# Altium project DC-DC_Converter.PrjPcb
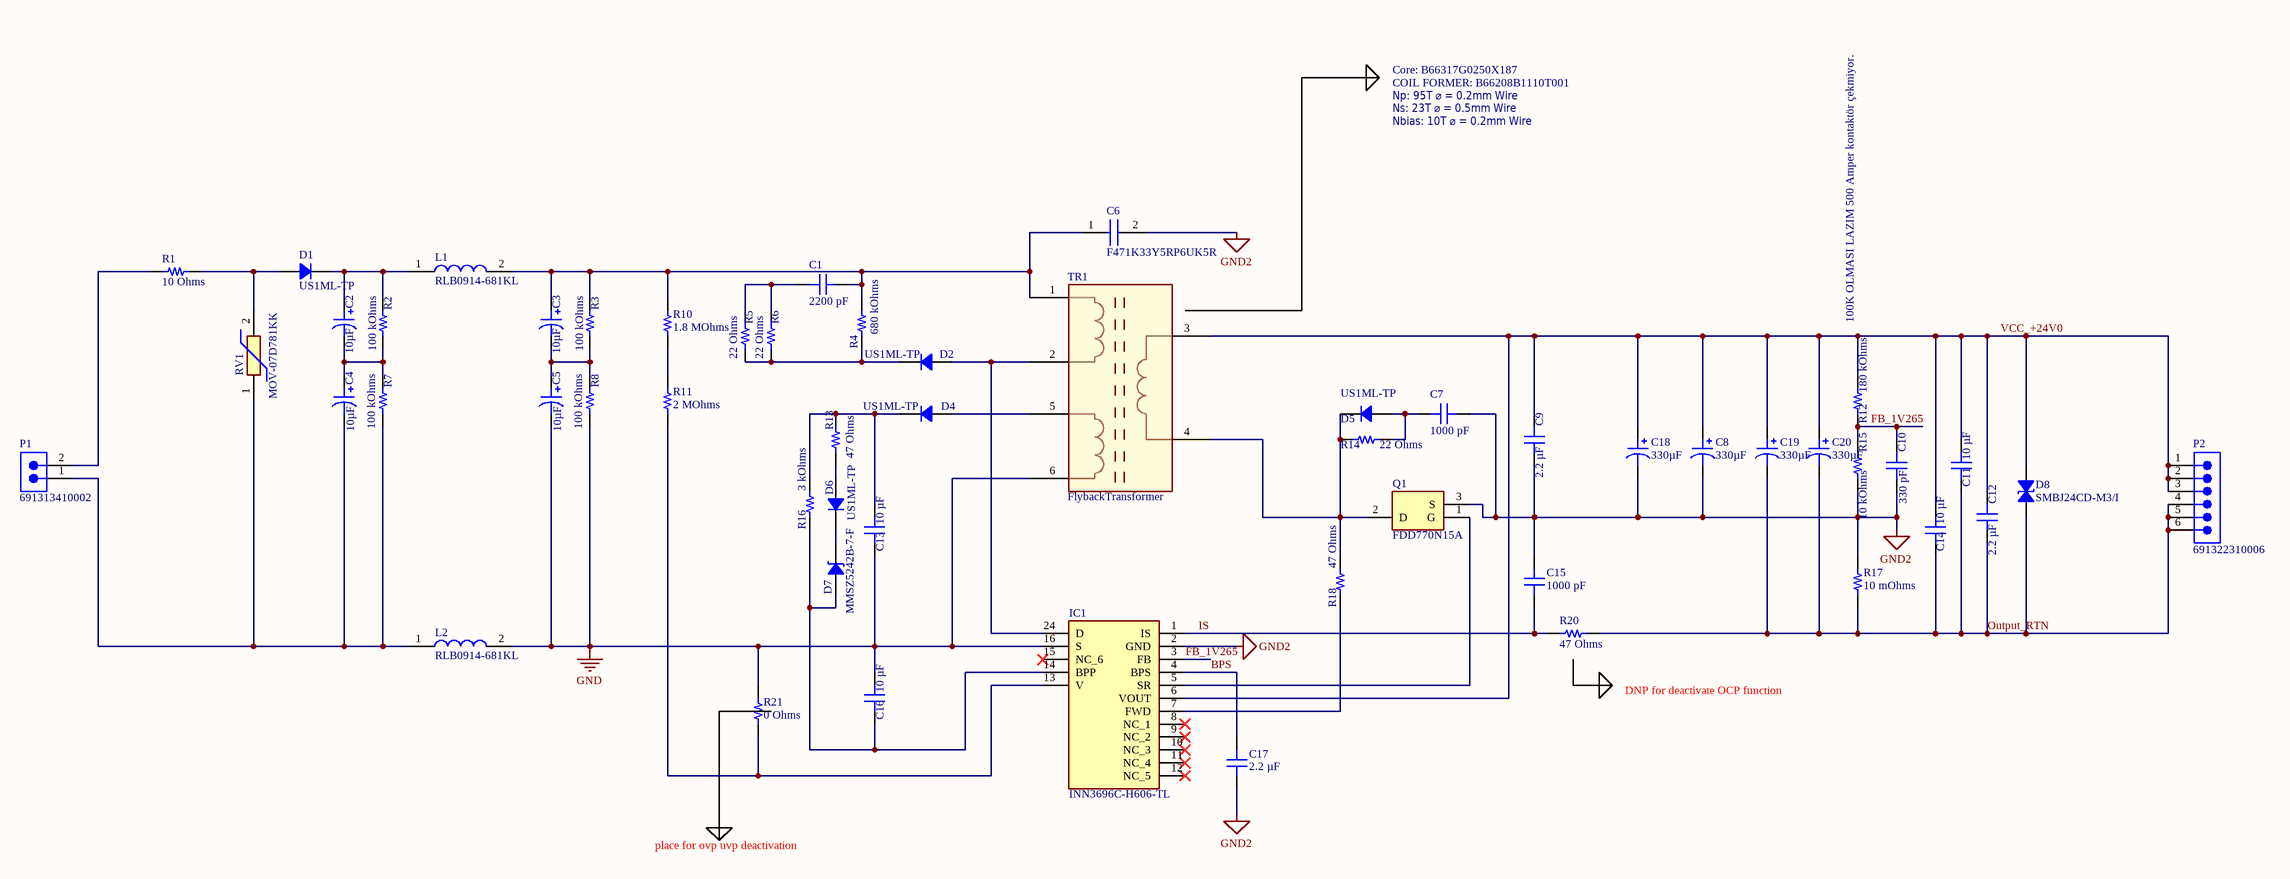
[diagram p0: Main.SchDoc]
CAGE_CODE: ?????; CONTRACT_NUMBER: <CONTRACT NO>; DOC_NO_ASSY_DWG: <ASSY DWG NO>; DOC_NO_BOM: <BOM DOC NO>; DOC_NO_FAB_DWG: <FAB DWG NO>; DOC_NO_SCH_DWG: <SCH DWG NO>; PCB_2_DEC_TOL: +/-.01; PCB_3_DEC_TOL: +/-.010; PCB_ANG_TOL: +/-1/2; PCB_ASSEMBLY_NO: <PCB ASSY NO>; PCB_CHECKER: - -----; PCB_CHECKER_APP_DATE: --/--/----; PCB_DESIGNER: - -----; PCB_DESIGNER_APP_DATE: --/--/----; PCB_DWG_NO: <PCB DWG NO>; PCB_ENGINEER: - -----; PCB_ENGINEER_APP_DATE: --/--/----; PCB_PART_NUMBER: <PCB PN>; PCB_REV: A; SCH_REV: A
1 sheet, 54 parts. Net scope: global (net labels, ports and power ports of the same name join across sheets).
Board file: PCB1.PcbDoc

## Sheet Main.SchDoc
size C; SheetNumber: 1; SheetTotal: 1

### Parts
C1  value 2200 pF  [CAP 1206_3216 - 0.8MM]  (hidden comment: C1206X222KGRAC7800)
C2  value 10µF  [CAP TH ALUM ELEC D10.00mm S5.00mm H17.00mm]  (hidden comment: ESK106M400AH2EA)
C3  value 10µF  [CAP TH ALUM ELEC D10.00mm S5.00mm H17.00mm]  (hidden comment: ESK106M400AH2EA)
C4  value 10µF  [CAP TH ALUM ELEC D10.00mm S5.00mm H17.00mm]  (hidden comment: ESK106M400AH2EA)
C5  value 10µF  [CAP TH ALUM ELEC D10.00mm S5.00mm H17.00mm]  (hidden comment: ESK106M400AH2EA)
C6  F471K33Y5RP6UK5R  [F471K33Y5RP6UK5R]
C7  value 1000 pF  [CAP 0603_1608]  (hidden comment: CL10B102KB8NNNC)
C8  value 330µF  [CAP TH ALUM ELEC D10.00mm S5.00mm H14.00mm]  (hidden comment: UVY1V331MPD1TD)
C9  value 2.2 µF  [CAP 1206_3216 - 0.8MM]  (hidden comment: CL31B225KBHNNNE)
C10  value 330 pF  [CAP 1206_3216 - 0.8MM]  (hidden comment: 885012208072)
C11  value 10 µF  [CAP 1206_3216 - 0.8MM]  (hidden comment: CL31A106MBHNNNE)
C12  value 2.2 µF  [CAP 1206_3216 - 0.8MM]  (hidden comment: CL31B225KBHNNNE)
C13  value 10 µF  [CAP 1206_3216 - 0.8MM]  (hidden comment: CL31A106MBHNNNE)
C14  value 10 µF  [CAP 1206_3216 - 0.8MM]  (hidden comment: CL31A106MBHNNNE)
C15  value 1000 pF  [CAP 0603_1608]  (hidden comment: CL10B102KB8NNNC)
C16  value 10 µF  [CAP 1206_3216 - 0.8MM]  (hidden comment: CL31A106MBHNNNE)
C17  value 2.2 µF  [CAP 1206_3216 - 0.8MM]  (hidden comment: CL31B225KBHNNNE)
C18  value 330µF  [CAP TH ALUM ELEC D10.00mm S5.00mm H14.00mm]  (hidden comment: UVY1V331MPD1TD)
C19  value 330µF  [CAP TH ALUM ELEC D10.00mm S5.00mm H14.00mm]  (hidden comment: UVY1V331MPD1TD)
C20  value 330µF  [CAP TH ALUM ELEC D10.00mm S5.00mm H14.00mm]  (hidden comment: UVY1V331MPD1TD)
D1  US1ML-TP  [DO214AC SMA]
D2  US1ML-TP  [DO214AC SMA]
D4  US1ML-TP  [DO214AC SMA]
D5  US1ML-TP  [DO214AC SMA]
D6  US1ML-TP  [DO214AC SMA]
D7  MMSZ5242B-7-F  [SOD-123]
D8  SMBJ24CD-M3/I  [DO214AA SMB]
IC1  INN3696C-H606-TL  [INN3696CH606TL]
L1  RLB0914-681KL  [RLB0914681KL]
L2  RLB0914-681KL  [RLB0914681KL]
P1  691313410002  [691313410002]
P2  691322310006  [691322310006]
Q1  FDD770N15A  [FDD770N15A]
R1  value 10 Ohms  [RES 2512_6432]  (hidden comment: RMCF2512JT10R0)
R2  value 100 kOhms  [RES 1206_3216]  (hidden comment: RMCF1206FT100K)
R3  value 100 kOhms  [RES 1206_3216]  (hidden comment: RMCF1206FT100K)
R4  value 680 kOhms  [RES 1206_3216]  (hidden comment: RC1206FR-07680KL)
R5  value 22 Ohms  [RES 1206_3216]  (hidden comment: RC1206JR-7W22RL)
R6  value 22 Ohms  [RES 1206_3216]  (hidden comment: RC1206JR-7W22RL)
R7  value 100 kOhms  [RES 1206_3216]  (hidden comment: RMCF1206FT100K)
R8  value 100 kOhms  [RES 1206_3216]  (hidden comment: RMCF1206FT100K)
R10  value 1.8 MOhms  [RES 1206_3216]  (hidden comment: RC1206FR-071M8L)
R11  value 2 MOhms  [RES 1206_3216]  (hidden comment: RC1206JR-072ML)
R12  value 180 kOhms  [RES 1206_3216]  (hidden comment: RC1206JR-07180KL)
R13  value 47 Ohms  [RES 1206_3216]  (hidden comment: RC1206JR-0747RL)
R14  value 22 Ohms  [RES 1206_3216]  (hidden comment: RC1206JR-7W22RL)
R15  value 10 kOhms  [RES 1206_3216]  (hidden comment: RC1206FR-0710KL)
R16  value 3 kOhms  [RES 1206_3216]  (hidden comment: RC1206JR-073KL)
R17  value 10 mOhms  [RES 1206_3216]  (hidden comment: PA1206FRE070R01Z)
R18  value 47 Ohms  [RES 1206_3216]  (hidden comment: RC1206JR-0747RL)
R20  value 47 Ohms  [RES 1206_3216]  (hidden comment: RC1206JR-0747RL)
R21  value 0 Ohms  [RES 1206_3216]  (hidden comment: RC1206JR-070RL)
RV1  MOV-07D781KK  [MOV07D781KK]
TR1  FlybackTransformer  [FlybackTransformer]

### Nets
GND: C5.2 C13.1 C16.2 IC1.16(S) L2.2 R8.1 R21.2 TR1.6
GND2: C6.2 C7.2 C8.2 C9.1 C10.1 C15.2 C17.2 C18.2 IC1.2(GND) Q1.3(S) R15.1 R17.2
BPS: C17.1 IC1.4(BPS)
FB_1V265: C10.2 IC1.3(FB) R12.1 R15.2
IS: C15.1 IC1.1(IS) R20.2
Output_RTN: C11.1 C12.1 C14.1 C19.2 C20.2 D8.1 P2.4 P2.5 P2.6 R17.1 R20.1
VCC_+24V0: C8.1 C9.2 C11.2 C12.2 C14.2 C18.1 C19.1 C20.1 D8.2 IC1.6(VOUT) P2.1 P2.2 P2.3 R12.2 TR1.3
NetC1_1: C1.1 R5.2 R6.2
NetC1_2: C1.2 C3.1 C6.1 L1.2 R3.2 R4.2 R10.2 TR1.1
NetC2_1: C2.1 D1.2 L1.1 R2.2
NetC2_2: C2.2 C4.1 R2.1 R7.2
NetC3_2: C3.2 C5.1 R3.1 R8.2
NetC4_2: C4.2 L2.1 P1.1 R7.1 RV1.1
NetC7_1: C7.1 D5.1 R14.1
NetC13_2: C13.2 D4.2 R13.2 R16.2
NetC16_1: C16.1 D7.1 IC1.14(BPP) R16.1
NetD1_1: D1.1 R1.2 RV1.2
NetD2_1: D2.1 IC1.24(D) TR1.2
NetD2_2: D2.2 R4.1 R5.1 R6.1
NetD4_1: D4.1 TR1.5
NetD5_2: D5.2 Q1.2(D) R14.2 R18.2 TR1.4
NetD6_1: D6.1 R13.1
NetD6_2: D6.2 D7.2
NetIC1_5: IC1.5(SR) Q1.1(G)
NetIC1_7: IC1.7(FWD) R18.1
NetIC1_13: IC1.13(V) R11.1 R21.1
NetP1_2: P1.2 R1.1
NetR10_1: R10.1 R11.2

Not connected (* = marked no-connect by the designer): IC1 8(NC_1)* 9(NC_2)* 10(NC_3)* 11(NC_4)* 12(NC_5)* 15(NC_6)*

### Notes on the sheet
- Core: B66317G0250X187
- COIL FORMER: B66208B1110T001
- Np: 95T ⌀ = 0.2mm Wire
- Ns: 23T ⌀ = 0.5mm Wire
- Nbias: 10T ⌀ = 0.2mm Wire
- 100K OLMASI LAZIM 500 Amper kontaktör çekmiyor.
- DNP for deactivate OCP function
- place for ovp uvp deactivation

### Library data of the parts
C1 = CMP-216-004562-1: CAP CER 2200PF 2KV X7R 1206; manufacturer: KEMET; Voltage - Rated: 2000V (2kV); Tolerance: ±10%; Mounting Type: Surface Mount, MLCC; price: 0.16; Package / Case: 1206 (3216 Metric); Operating Temperature: -55°C ~ 125°C; Lifecycle Status: Active; Device Package: 1206 (3216 Metric); ComponentLink2URL: https://www.digikey.com/en/products/detail/kemet/C1206X222KGRAC7800/6126197; lastupdated: 9/4/2023 7:14:42 PM; ComponentLink2Description: DigiKey Link; Part Status: Active; Thickness (Max): 0.073" (1.85mm); Temperature Coefficient: X7R; series: SMD Comm X7R HV Flex; ComponentLink1Description: Datasheet; Applications: Boardflex Sensitive; partid: 41595; Part Number: C1206X222KGRAC7800; packaging: TapeAndReel; Minimum Order: 1; Capacitance: 2200 pF; ComponentLink1URL: https://api.kemet.com/component-edge/download/datasheet/C1206X222KGRAC7800.pdf; Features: Low ESL, Soft Termination, High Voltage; Size / Dimension: 0.130" L x 0.063" W (3.30mm x 1.60mm)
C2-C5 = CMP-208-002450-1: CAP ALUM 10UF 20% 400V THRUHOLE; manufacturer: KEMET; Lifetime @ Temp.: 2000 Hrs @ 85°C; Polarization: Polar; Ripple Current @ High Frequency: 70mA @ 10kHz; Ripple Current @ Low Frequency: 50mA @ 120Hz; Voltage - Rated: 400V; lastupdated: 9/2/2020 1:31:20 AM; Part Number: ESK106M400AH2EA; Height - Seated (Max): 0.669" (17.00mm); price: 0.17; Applications: General Purpose; Package / Case: Radial, Can; Part Status: Active; Operating Temperature: -25°C ~ 85°C; packaging: TapeAndBox; Device Package: Radial, Can; ComponentLink2URL: http://digikey.com/product-detail/en/kemet/ESK106M400AH2EA/399-18271-1-ND/9448289; Mounting Type: Through Hole; ComponentLink2Description: DigiKey Link; Tolerance: ±20%; Lead Spacing: 0.197" (5.00mm); ComponentLink1URL: https://api.kemet.com/component-edge/download/datasheet/ESK106M400AH2EA.pdf; Minimum Order: 1; ComponentLink1Description: Datasheet; Size / Dimension: 0.394" Dia (10.00mm); series: ESK; partid: 11674; Lifecycle Status: Active; Capacitance: 10µF
C6 = F471K33Y5RP6UK5R: Capacitor; Manufacturer_Name: Vishay; Datasheet Link: https://www.vishay.com/docs/28500/fseries.pdf; Height: 8.5mm; Manufacturer_Part_Number: F471K33Y5RP6UK5R; Mouser Part Number: 594-F471K33Y5RP6UK5R; Mouser Price/Stock: https://www.mouser.co.uk/ProductDetail/Vishay-BC-Components/F471K33Y5RP6UK5R?qs=ftzNSb6%2F63rYeg13XZow8A%3D%3D; Arrow Part Number: F471K33Y5RP6UK5R; Arrow Price/Stock: https://www.arrow.com/en/products/f471k33y5rp6uk5r/vishay
C7 C15 = CMP-214-000786-1: CAP CER 1000PF 50V X7R 0603; manufacturer: Samsung Electro-Mechanics; Tolerance: ±10%; ComponentLink1Description: Datasheet; packaging: TapeAndReel; price: 0.01; ComponentLink2URL: https://www.digikey.com/en/products/detail/samsung-electro-mechanics/CL10B102KB8NNNC/3886676; ComponentLink1URL: http://www.samsungsem.com/kr/support/product-search/mlcc/CL10B102KB8NNNC.jsp; Applications: General Purpose; Package / Case: 0603 (1608 Metric); series: CL; partid: 5511; Part Status: Active; Operating Temperature: -55°C ~ 125°C; Thickness (Max): 0.035" (0.90mm); Mounting Type: Surface Mount, MLCC; ComponentLink2Description: DigiKey Link; Temperature Coefficient: X7R; Size / Dimension: 0.063" L x 0.031" W (1.60mm x 0.80mm); Voltage - Rated: 50V; Part Number: CL10B102KB8NNNC; Lifecycle Status: Active; Minimum Order: 1; Capacitance: 1000 pF; Device Package: 0603 (1608 Metric); lastupdated: 9/4/2023 7:08:47 PM
C8 C18-C20 = CMP-208-002055-1: CAP ALUM 330UF 20% 35V RADIAL; manufacturer: Nichicon; Polarization: Polar; Ripple Current @ Low Frequency: 350mA @ 120Hz; Lifetime @ Temp.: 1000 Hrs @ 105°C; price: 0.15; Part Status: Active; Lead Spacing: 0.197" (5.00mm); Package / Case: Radial, Can; partid: 11279; Height - Seated (Max): 0.551" (14.00mm); Device Package: Radial, Can; lastupdated: 9/2/2020 1:31:12 AM; Capacitance: 330µF; ComponentLink1URL: http://nichicon-us.com/english/products/pdfs/e-uvy.pdf; Part Number: UVY1V331MPD1TD; ComponentLink2URL: http://digikey.com/product-detail/en/nichicon/UVY1V331MPD1TD/493-12941-1-ND/4328558; Mounting Type: Through Hole; ComponentLink1Description: Datasheet; Applications: General Purpose; ComponentLink2Description: DigiKey Link; Operating Temperature: -55°C ~ 105°C; Minimum Order: 1; series: UVY; Tolerance: ±20%; Size / Dimension: 0.394" Dia (10.00mm); Lifecycle Status: Active; packaging: TapeAndBox; Voltage - Rated: 35V
C9 C12 C17 = CMP-216-001888-1: CAP CER 2.2UF 50V X7R 1206; manufacturer: Samsung Electro-Mechanics; Tolerance: ±10%; Part Status: Active; Thickness (Max): 0.071" (1.80mm); series: CL; Minimum Order: 1; Size / Dimension: 0.126" L x 0.063" W (3.20mm x 1.60mm); lastupdated: 9/4/2023 7:14:28 PM; Applications: General Purpose; Mounting Type: Surface Mount, MLCC; Device Package: 1206 (3216 Metric); ComponentLink1Description: Datasheet; Operating Temperature: -55°C ~ 125°C; ComponentLink2Description: DigiKey Link; ComponentLink2URL: https://www.digikey.com/en/products/detail/samsung-electro-mechanics/CL31B225KBHNNNE/3886949; Lifecycle Status: Active; partid: 21783; Voltage - Rated: 50V; Temperature Coefficient: X7R; packaging: TapeAndReel; Package / Case: 1206 (3216 Metric); price: 0.03; Part Number: CL31B225KBHNNNE; ComponentLink1URL: http://www.samsungsem.com/kr/support/product-search/mlcc/CL31B225KBHNNNE.jsp; Capacitance: 2.2 µF
C10 = CMP-216-003309-1: CAP CER 330PF 50V X7R 1206; manufacturer: Würth Elektronik; Tolerance: ±10%; packaging: TapeAndReel; Minimum Order: 1; Voltage - Rated: 50V; Size / Dimension: 0.126" L x 0.063" W (3.20mm x 1.60mm); Package / Case: 1206 (3216 Metric); ComponentLink2Description: DigiKey Link; Part Status: Active; lastupdated: 9/4/2023 7:14:05 PM; Lifecycle Status: Active; Device Package: 1206 (3216 Metric); Mounting Type: Surface Mount, MLCC; Thickness (Max): 0.035" (0.90mm); ComponentLink1Description: Datasheet; price: 0.06; Part Number: 885012208072; ComponentLink2URL: https://www.digikey.com/en/products/detail/würth-elektronik/885012208072/5453967; Operating Temperature: -55°C ~ 125°C; Capacitance: 330 pF; series: WCAP-CSGP; partid: 30869; Applications: General Purpose; ComponentLink1URL: https://www.we-online.com/katalog/datasheet/885012208072.pdf; Temperature Coefficient: X7R
C11 C13 C14 C16 = CMP-216-001901-1: CAP CER 10UF 50V X5R 1206; manufacturer: Samsung Electro-Mechanics; Tolerance: ±20%; ComponentLink2URL: https://www.digikey.com/en/products/detail/samsung-electro-mechanics/CL31A106MBHNNNE/5961220; series: CL; Mounting Type: Surface Mount, MLCC; Part Status: Active; partid: 21805; Operating Temperature: -55°C ~ 85°C; price: 0.04; ComponentLink2Description: DigiKey Link; Size / Dimension: 0.126" L x 0.063" W (3.20mm x 1.60mm); lastupdated: 9/4/2023 7:14:28 PM; Applications: General Purpose; ComponentLink1Description: Datasheet; Package / Case: 1206 (3216 Metric); ComponentLink1URL: http://www.samsungsem.com/kr/support/product-search/mlcc/CL31A106MBHNNNE.jsp; Voltage - Rated: 50V; Temperature Coefficient: X5R; Lifecycle Status: Active; Device Package: 1206 (3216 Metric); Part Number: CL31A106MBHNNNE; packaging: TapeAndReel; Thickness (Max): 0.071" (1.80mm); Capacitance: 10 µF; Minimum Order: 1
D1 D2 D4-D6 = CMP-254-000890-1: DIODE GEN PURP 1KV 1A DO214AC; Manufacturer: Micro Commercial Co; Current - Reverse Leakage @ Vr: 5 µA @ 1000 V; Voltage - Forward (Vf) (Max) @ If: 1.5 V @ 1 A; Diode Type: Standard; Capacitance @ Vr, F: 8pF @ 4V, 1MHz; Speed: Fast Recovery =< 500ns, > 200mA (Io); Voltage - DC Reverse (Vr) (Max): 1000 V; Reverse Recovery Time (trr): 120 ns; Mounting Type: Surface Mount; Part Number: US1ML-TP; Current - Average Rectified (Io): 1A; Operating Temperature - Junction: -55°C ~ 150°C; Supplier Device Package: DO-214AC (SMA); Packaging: TapeAndReel; PartId: 891; Minimum Order: 1; ComponentLink1Description: Datasheet; Price: 0.04; LastUpdated: 9/4/2023 8:16:02 PM; ComponentLink2URL: https://www.digikey.com/en/products/detail/micro-commercial-co/US1ML-TP/7681879; Lifecycle Status: Active; Series: -; ComponentLink1URL: https://www.mccsemi.com/pdf/Products/US1ML(DO-214AC)-A.pdf; ComponentLink2Description: DigiKey Link; Package / Case: DO-214AC, SMA; Part Status: Active
D7 = CMP-257-001455-1: DIODE ZENER 12V 500MW SOD123; Manufacturer: Diodes Incorporated; Voltage - Forward (Vf) (Max) @ If: 900 mV @ 10 mA; Current - Reverse Leakage @ Vr: 1 µA @ 9.1 V; Impedance (Max) (Zzt): 30 Ohms; Tolerance: ±5%; Part Number: MMSZ5242B-7-F; Package / Case: SOD-123; ComponentLink1URL: https://www.diodes.com/assets/Datasheets/ds18010.pdf; Mounting Type: Surface Mount; Supplier Device Package: SOD-123; Voltage - Zener (Nom) (Vz): 12 V; ComponentLink1Description: Datasheet; Lifecycle Status: Active; Packaging: TapeAndReel; Series: -; ComponentLink2URL: https://www.digikey.com/en/products/detail/diodes-incorporated/MMSZ5242B-7-F/814367; Part Status: Active; Minimum Order: 1; LastUpdated: 9/4/2023 8:17:16 PM; Power - Max: 500 mW; PartId: 2231; ComponentLink2Description: DigiKey Link; Price: 0.02; Operating Temperature: -65°C ~ 150°C
D8 = CMP-255-003391-1: TVS DIODE 24V 38.4V DO214AA; Manufacturer: Vishay Semiconductor Diodes Division; Type: Zener; Power - Peak Pulse: 600W; Power Line Protection: No; Bidirectional Channels: 1; Voltage - Breakdown (Min): 27.1V; Current - Peak Pulse (10/1000µs): 15.6A; ComponentLink1Description: Datasheet; Supplier Device Package: DO-214AA (SMBJ); PartId: 8867; Package / Case: DO-214AA, SMB; Mounting Type: Surface Mount; Operating Temperature: -55°C ~ 150°C (TJ); Price: 0.11; Packaging: TapeAndReel; Applications: General Purpose; Part Status: Active; ComponentLink1URL: http://www.vishay.com/docs/87606/87606.pdf; Voltage - Clamping (Max) @ Ipp: 38.4V; Voltage - Reverse Standoff (Typ): 24V; LastUpdated: 9/4/2023 8:39:18 PM; Minimum Order: 1; Part Number: SMBJ24CD-M3/I; ComponentLink2Description: DigiKey Link; ComponentLink2URL: http://digikey.com/product-detail/en/vishay-semiconductor-diodes-division/SMBJ24CD-M3-I/SMBJ24CD-M3-IGICT-ND/7915510; Series: TransZorb®; Lifecycle Status: Active
IC1 = CMP-031-00006-1: AC/DC Converters 35W 230VAC 30W 15mW 900V FET; Manufacturer_Name: Power Integrations; Datasheet Link: https://ac-dc.power.com/sites/default/files/product_document/data_sheet/innoswitch3-ep_family_datasheet.pdf; Source: SamacSys.SchLib; Mouser Part Number: 869-INN3696C-H606-TL; Design Item ID: INN3696C-H606-TL; Mouser Price/Stock: https://www.mouser.co.uk/ProductDetail/Power-Integrations/INN3696C-H606-TL?qs=T3oQrply3y%252BBKBkU3yymrA%3D%3D; Manufacturer_Part_Number: INN3696C-H606-TL; Height: 1.6mm
L1 L2 = RLB0914-681KL: Inductor; Manufacturer_Name: Bourns; Datasheet Link: https://www.bourns.com/docs/Product-Datasheets/rlb.pdf; Height: 13mm; Manufacturer_Part_Number: RLB0914-681KL; Mouser Part Number: 652-RLB0914-681KL; Mouser Price/Stock: https://www.mouser.co.uk/ProductDetail/Bourns/RLB0914-681KL?qs=AC4ivEYFOTCNo0lEn%252BtUFw%3D%3D; Arrow Part Number: RLB0914-681KL; Arrow Price/Stock: https://www.arrow.com/en/products/rlb0914-681kl/bourns
P1 = CMP-002-02061-1: WR-TBL Series 3134 Close Horizontal PCB Header, THT, pitch 7.62mm, 2p; Manufacturer: Wurth Elektronik; Rated Current: 20A; Modularity: No; Working Voltage: 300V; Number of Rows: 1; Pins: 2; Category: Terminal Blocks; Operating Temperature Max: 105°C; Packaging: Box; ComponentLink2Description: Datasheet Link; Orientation: Horizontal; ComponentLink1Description: Website Link; Match Code: WR-TBL; Mount: Through Hole; Operating Temperature Min: -40°C; Pitch: 7.62mm; ComponentLink1URL: https://www.we-online.com/redexpert/article/691313410002?ad; ComponentLink2URL: https://www.we-online.com/redexpert/spec/691313410002?ad; Application: Pluggable; Manufacturer Part Number: 691313410002
P2 = CMP-002-02226-1: WR-TBL Series 322 Horizontal PCB Header, THT, pitch 3.81mm, 6p; Manufacturer: Wurth Elektronik; Working Voltage: 300V; Modularity: No; Rated Current: 10A; Pitch: 3.81mm; ComponentLink2Description: Datasheet Link; Pins: 6; Category: Terminal Blocks; ComponentLink2URL: https://www.we-online.com/redexpert/spec/691322310006?ad; Number of Rows: 1; Operating Temperature Max: 105°C; Manufacturer Part Number: 691322310006; Packaging: Box; Mount: Through Hole; ComponentLink1URL: https://www.we-online.com/redexpert/article/691322310006?ad; Orientation: Horizontal; Operating Temperature Min: -40°C; Application: Pluggable; Match Code: WR-TBL; ComponentLink1Description: Website Link
Q1 = FDD770N15A: Transistor; Manufacturer_Name: onsemi; Datasheet Link: https://componentsearchengine.com/Datasheets/2/FDD770N15A.pdf; Height: 2.39mm; Manufacturer_Part_Number: FDD770N15A; Mouser Part Number: 512-FDD770N15A; Mouser Price/Stock: https://www.mouser.co.uk/ProductDetail/onsemi-Fairchild/FDD770N15A?qs=%2FrNExBQRqERIwYieQRWQ%252Bg%3D%3D; Arrow Part Number: FDD770N15A; Arrow Price/Stock: https://www.arrow.com/en/products/fdd770n15a/on-semiconductor?region=nac
R1 = CMP-331-003356-1: RES 10 OHM 5% 1W 2512; Manufacturer: Stackpole Electronics Inc; Temperature Coefficient: ±200ppm/°C; ComponentLink2URL: http://digikey.com/product-detail/en/stackpole-electronics-inc/RMCF2512JT10R0/RMCF2512JT10R0CT-ND/1942610; Price: 0.03; Resistance: 10 Ohms; Size / Dimension: 0.248" L x 0.126" W (6.30mm x 3.20mm); ComponentLink1Description: Datasheet; Power (Watts): 1W; Tolerance: ±5%; Device Package: 2512 (6432 Metric); ComponentLink2Description: DigiKey Link; Part Number: RMCF2512JT10R0; LastUpdated: 9/2/2020 1:27:06 AM; ComponentLink1URL: https://www.seielect.com/catalog/sei-rmcf_rmcp.pdf; Ratings: AEC-Q200; Features: Automotive AEC-Q200; Packaging: TapeAndReel; Part Status: Active; Series: RMCF; Supplier Device Package: 2512; Composition: Thick Film; Lifecycle Status: Active; Package / Case: 2512 (6432 Metric); Number of Terminations: 2; Minimum Order: 1; Height - Seated (Max): 0.028" (0.70mm); Operating Temperature: -55°C ~ 155°C
R2 R3 R7 R8 = CMP-329-006653-1: RES 100K OHM 1% 1/4W 1206; Manufacturer: Stackpole Electronics Inc; Power (Watts): 0.25W, 1/4W; Temperature Coefficient: ±100ppm/°C; Ratings: AEC-Q200; Height - Seated (Max): 0.028" (0.70mm); ComponentLink1URL: https://www.seielect.com/catalog/sei-rmcf_rmcp.pdf; Features: Automotive AEC-Q200; Series: RMCF; Operating Temperature: -55°C ~ 155°C; LastUpdated: 9/4/2023 7:43:30 PM; ComponentLink1Description: Datasheet; Number of Terminations: 2; Part Number: RMCF1206FT100K; PartId: 39304; ComponentLink2Description: DigiKey Link; Tolerance: ±1%; Minimum Order: 1; ComponentLink2URL: https://www.digikey.com/en/products/detail/stackpole-electronics-inc/RMCF1206FT100K/1759689; Price: 0.01; Size / Dimension: 0.126" L x 0.063" W (3.20mm x 1.60mm); Composition: Thick Film; Packaging: TapeAndReel; Resistance: 100 kOhms; Device Package: 1206 (3216 Metric); Package / Case: 1206 (3216 Metric); Supplier Device Package: 1206; Part Status: Active; Lifecycle Status: Active
R4 = CMP-329-005710-1: RES 680K OHM 1% 1/4W 1206; Manufacturer: Yageo; Power (Watts): 0.25W, 1/4W; Temperature Coefficient: ±100ppm/°C; ComponentLink1Description: Datasheet; LastUpdated: 9/4/2023 7:43:38 PM; PartId: 37411; Series: RC_L; Part Number: RC1206FR-07680KL; Packaging: TapeAndReel; ComponentLink1URL: https://www.yageo.com/upload/media/product/productsearch/datasheet/rchip/PYu-RC_Group_51_RoHS_L_10.pdf; Operating Temperature: -55°C ~ 155°C; Supplier Device Package: 1206; Resistance: 680 kOhms; Package / Case: 1206 (3216 Metric); Minimum Order: 1; ComponentLink2URL: https://www.digikey.com/en/products/detail/yageo/RC1206FR-07680KL/729065; Device Package: 1206 (3216 Metric); Composition: Thick Film; Part Status: Active; Lifecycle Status: Active; Price: 0.01; ComponentLink2Description: DigiKey Link; Number of Terminations: 2; Features: Moisture Resistant; Height - Seated (Max): 0.026" (0.65mm); Tolerance: ±1%; Size / Dimension: 0.122" L x 0.063" W (3.10mm x 1.60mm)
R5 R6 R14 = CMP-329-010863-1: RES 22 OHM 5% 1/2W 1206; Manufacturer: Yageo; Power (Watts): 0.5W, 1/2W; Temperature Coefficient: ±200ppm/°C; Minimum Order: 1; ComponentLink1URL: https://www.yageo.com/upload/media/product/productsearch/datasheet/rchip/PYu-RC_Group_51_RoHS_L_11.pdf; Package / Case: 1206 (3216 Metric); Packaging: TapeAndReel; Series: RC_L; LastUpdated: 9/4/2023 7:42:52 PM; Device Package: 1206 (3216 Metric); Size / Dimension: 0.122" L x 0.063" W (3.10mm x 1.60mm); ComponentLink1Description: Datasheet; Operating Temperature: -55°C ~ 155°C; Price: 0.02; ComponentLink2Description: DigiKey Link; Part Status: Active; Composition: Thick Film; Lifecycle Status: Active; Features: Moisture Resistant; Supplier Device Package: 1206; Tolerance: ±5%; Height - Seated (Max): 0.026" (0.65mm); Part Number: RC1206JR-7W22RL; PartId: 58538; Number of Terminations: 2; ComponentLink2URL: https://www.digikey.com/en/products/detail/yageo/RC1206JR-7W22RL/12698851; Resistance: 22 Ohms
R10 = CMP-329-003141-1: RES 1.8M OHM 1% 1/4W 1206; Manufacturer: Yageo; Temperature Coefficient: ±100ppm/°C; Power (Watts): 0.25W, 1/4W; Part Number: RC1206FR-071M8L; Price: 0.01; ComponentLink2Description: DigiKey Link; Tolerance: ±1%; Device Package: 1206 (3216 Metric); Package / Case: 1206 (3216 Metric); Features: Moisture Resistant; Number of Terminations: 2; Minimum Order: 1; Size / Dimension: 0.122" L x 0.063" W (3.10mm x 1.60mm); Lifecycle Status: Active; Composition: Thick Film; Series: RC_L; ComponentLink1URL: https://www.yageo.com/upload/media/product/productsearch/datasheet/rchip/PYu-RC_Group_51_RoHS_L_10.pdf; Operating Temperature: -55°C ~ 155°C; Height - Seated (Max): 0.026" (0.65mm); LastUpdated: 9/4/2023 7:43:59 PM; ComponentLink2URL: https://www.digikey.com/en/products/detail/yageo/RC1206FR-071M8L/728469; Part Status: Active; Packaging: TapeAndReel; Supplier Device Package: 1206; Resistance: 1.8 MOhms; PartId: 32269; ComponentLink1Description: Datasheet
R11 = CMP-329-007943-1: RES 2M OHM 5% 1/4W 1206; Manufacturer: Yageo; Power (Watts): 0.25W, 1/4W; Temperature Coefficient: ±100ppm/°C; Minimum Order: 1; Tolerance: ±5%; PartId: 41862; Price: 0.01; ComponentLink2Description: DigiKey Link; Operating Temperature: -55°C ~ 155°C; Packaging: TapeAndReel; Height - Seated (Max): 0.026" (0.65mm); Features: Moisture Resistant; Size / Dimension: 0.122" L x 0.063" W (3.10mm x 1.60mm); Part Number: RC1206JR-072ML; Package / Case: 1206 (3216 Metric); Lifecycle Status: Active; Resistance: 2 MOhms; ComponentLink1Description: Datasheet; ComponentLink1URL: https://www.yageo.com/upload/media/product/productsearch/datasheet/rchip/PYu-RC_Group_51_RoHS_L_10.pdf; Composition: Thick Film; Device Package: 1206 (3216 Metric); Supplier Device Package: 1206; LastUpdated: 9/4/2023 7:43:19 PM; Series: RC_L; ComponentLink2URL: https://www.digikey.com/en/products/detail/yageo/RC1206JR-072ML/729237; Number of Terminations: 2; Part Status: Active
R12 = CMP-329-007945-1: RES 180K OHM 5% 1/4W 1206; Manufacturer: Yageo; Power (Watts): 0.25W, 1/4W; Temperature Coefficient: ±100ppm/°C; Resistance: 180 kOhms; LastUpdated: 9/4/2023 7:43:19 PM; Supplier Device Package: 1206; Lifecycle Status: Active; Packaging: TapeAndReel; Height - Seated (Max): 0.026" (0.65mm); Size / Dimension: 0.122" L x 0.063" W (3.10mm x 1.60mm); Part Number: RC1206JR-07180KL; Composition: Thick Film; Series: RC_L; Part Status: Active; Tolerance: ±5%; ComponentLink1Description: Datasheet; Device Package: 1206 (3216 Metric); ComponentLink1URL: https://www.yageo.com/upload/media/product/productsearch/datasheet/rchip/PYu-RC_Group_51_RoHS_L_10.pdf; ComponentLink2URL: https://www.digikey.com/en/products/detail/yageo/RC1206JR-07180KL/729232; ComponentLink2Description: DigiKey Link; Number of Terminations: 2; Features: Moisture Resistant; Operating Temperature: -55°C ~ 155°C; Minimum Order: 1; Price: 0.01; PartId: 41866; Package / Case: 1206 (3216 Metric)
R13 R18 R20 = CMP-329-000945-1: RES 47 OHM 5% 1/4W 1206; Manufacturer: Yageo; Temperature Coefficient: ±100ppm/°C; Power (Watts): 0.25W, 1/4W; Resistance: 47 Ohms; Part Number: RC1206JR-0747RL; Packaging: TapeAndReel; Part Status: Active; ComponentLink1Description: Datasheet; Size / Dimension: 0.122" L x 0.063" W (3.10mm x 1.60mm); ComponentLink2Description: DigiKey Link; Features: Moisture Resistant; Series: RC_L; Composition: Thick Film; ComponentLink2URL: https://www.digikey.com/en/products/detail/yageo/RC1206JR-0747RL/2827653; Minimum Order: 1; LastUpdated: 9/4/2023 7:44:16 PM; Price: 0.01; Package / Case: 1206 (3216 Metric); Device Package: 1206 (3216 Metric); Number of Terminations: 2; Supplier Device Package: 1206; Height - Seated (Max): 0.026" (0.65mm); Tolerance: ±5%; ComponentLink1URL: https://www.yageo.com/upload/media/product/productsearch/datasheet/rchip/PYu-RC_Group_51_RoHS_L_10.pdf; Lifecycle Status: Active; PartId: 27879; Operating Temperature: -55°C ~ 155°C
R15 = CMP-329-006607-1: RES 10K OHM 1% 1/4W 1206; Manufacturer: Yageo; Temperature Coefficient: ±100ppm/°C; Power (Watts): 0.25W, 1/4W; PartId: 39204; ComponentLink1Description: Datasheet; Resistance: 10 kOhms; Supplier Device Package: 1206; Minimum Order: 1; Device Package: 1206 (3216 Metric); Packaging: TapeAndReel; Size / Dimension: 0.122" L x 0.063" W (3.10mm x 1.60mm); LastUpdated: 9/4/2023 7:43:30 PM; Tolerance: ±1%; Series: RC_L; Features: Moisture Resistant; Part Number: RC1206FR-0710KL; Composition: Thick Film; Price: 0.01; ComponentLink2URL: https://www.digikey.com/en/products/detail/yageo/RC1206FR-0710KL/728483; Package / Case: 1206 (3216 Metric); ComponentLink1URL: https://www.yageo.com/upload/media/product/productsearch/datasheet/rchip/PYu-RC_Group_51_RoHS_L_10.pdf; Part Status: Active; ComponentLink2Description: DigiKey Link; Number of Terminations: 2; Height - Seated (Max): 0.026" (0.65mm); Operating Temperature: -55°C ~ 155°C; Lifecycle Status: Active
R16 = CMP-329-000994-1: RES 3K OHM 5% 1/4W 1206; Manufacturer: Yageo; Temperature Coefficient: ±100ppm/°C; Power (Watts): 0.25W, 1/4W; Composition: Thick Film; Package / Case: 1206 (3216 Metric); ComponentLink2URL: https://www.digikey.com/en/products/detail/yageo/RC1206JR-073KL/729264; Lifecycle Status: Active; Number of Terminations: 2; Packaging: TapeAndReel; Tolerance: ±5%; ComponentLink2Description: DigiKey Link; Part Status: Active; Part Number: RC1206JR-073KL; Series: RC_L; Device Package: 1206 (3216 Metric); Minimum Order: 1; Size / Dimension: 0.122" L x 0.063" W (3.10mm x 1.60mm); ComponentLink1URL: https://www.yageo.com/upload/media/product/productsearch/datasheet/rchip/PYu-RC_Group_51_RoHS_L_10.pdf; Operating Temperature: -55°C ~ 155°C; LastUpdated: 9/4/2023 7:44:15 PM; PartId: 27969; Features: Moisture Resistant; Supplier Device Package: 1206; Resistance: 3 kOhms; ComponentLink1Description: Datasheet; Price: 0.01; Height - Seated (Max): 0.026" (0.65mm)
R17 = CMP-329-013774-1: RES 0.01 OHM 1% 1/4W 1206; Manufacturer: Yageo; Temperature Coefficient: ±50ppm/°C; Power (Watts): 0.25W, 1/4W; PartId: 75858; ComponentLink1Description: Datasheet; Operating Temperature: -55°C ~ 170°C; Height - Seated (Max): 0.026" (0.65mm); Tolerance: ±1%; ComponentLink1URL: https://www.yageo.com/upload/media/product/productsearch/datasheet/rchip/PYu-PA0100_2512_51_RoHS_2.pdf; Part Status: Active; Minimum Order: 1; Ratings: AEC-Q200; Lifecycle Status: Active; Resistance: 10 mOhms; Packaging: TapeAndReel; Features: Automotive AEC-Q200, Current Sense, Moisture Resistant; Price: 0.04; ComponentLink2URL: https://www.digikey.com/en/products/detail/yageo/PA1206FRE070R01Z/16641940; Part Number: PA1206FRE070R01Z; Supplier Device Package: 1206; Package / Case: 1206 (3216 Metric); Series: PA; LastUpdated: 9/4/2023 7:42:27 PM; Number of Terminations: 2; Device Package: 1206 (3216 Metric); Composition: Metal Element; Size / Dimension: 0.126" L x 0.063" W (3.20mm x 1.60mm); ComponentLink2Description: DigiKey Link
R21 = CMP-329-006639-1: RES 0 OHM JUMPER 1/4W 1206; Manufacturer: Yageo; Power (Watts): 0.25W, 1/4W; Size / Dimension: 0.122" L x 0.063" W (3.10mm x 1.60mm); ComponentLink1URL: https://www.yageo.com/upload/media/product/productsearch/datasheet/rchip/PYu-RC_Group_51_RoHS_L_10.pdf; Features: Moisture Resistant; Part Status: Active; Package / Case: 1206 (3216 Metric); Supplier Device Package: 1206; Series: RC_L; PartId: 39273; Minimum Order: 1; Price: 0.01; ComponentLink2Description: DigiKey Link; Resistance: 0 Ohms; LastUpdated: 9/4/2023 7:43:30 PM; Lifecycle Status: Active; Packaging: TapeAndReel; Height - Seated (Max): 0.026" (0.65mm); Operating Temperature: -55°C ~ 155°C; Part Number: RC1206JR-070RL; Number of Terminations: 2; Device Package: 1206 (3216 Metric); ComponentLink1Description: Datasheet; ComponentLink2URL: https://www.digikey.com/en/products/detail/yageo/RC1206JR-070RL/729184; Composition: Thick Film; Tolerance: Jumper
RV1 = MOV-07D781KK: Varistor; Manufacturer_Name: Bourns; Datasheet Link: https://www.bourns.com/docs/product-datasheets/mov07d.pdf; Height: 13.5mm; Manufacturer_Part_Number: MOV-07D781KK
TR1 = CMP-013-00040-5: B66317G0160X187 GAPPED N87 CORE; Source: FlybackTransformer.SchLib; Manufacturer_Part_Number: B66317G0160X187; ComponentLink1URL: *; Design Item ID: FlybackTransformer; ComponentLink1Description: New link